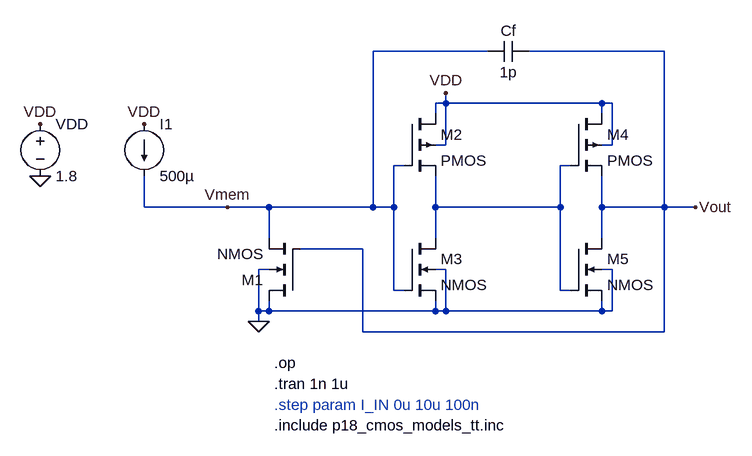
[diagram p0: schematic neuron.asc]
neuron.asc, the LTspice schematic file:
Version 4
SHEET 1 1432 888
WIRE 976 256 800 256
WIRE 1248 256 1040 256
WIRE 912 336 912 320
WIRE 912 336 896 336
WIRE 1152 336 912 336
WIRE 1168 336 1152 336
WIRE 896 352 896 336
WIRE 1152 352 1152 336
WIRE 912 400 912 336
WIRE 912 400 896 400
WIRE 1168 400 1168 336
WIRE 1168 400 1152 400
WIRE 848 432 832 432
WIRE 1104 432 1088 432
WIRE 448 496 448 448
WIRE 576 496 448 496
WIRE 640 496 576 496
WIRE 800 496 800 256
WIRE 800 496 640 496
WIRE 832 496 832 432
WIRE 832 496 800 496
WIRE 896 496 896 448
WIRE 1088 496 1088 432
WIRE 1088 496 896 496
WIRE 1152 496 1152 448
WIRE 1248 496 1248 256
WIRE 1248 496 1152 496
WIRE 1296 496 1248 496
WIRE 640 544 640 496
WIRE 896 544 896 496
WIRE 1152 544 1152 496
WIRE 784 560 688 560
WIRE 640 592 624 592
WIRE 912 592 896 592
WIRE 1168 592 1152 592
WIRE 832 624 832 496
WIRE 848 624 832 624
WIRE 1088 624 1088 496
WIRE 1104 624 1088 624
WIRE 624 656 624 592
WIRE 640 656 640 640
WIRE 640 656 624 656
WIRE 896 656 896 640
WIRE 896 656 640 656
WIRE 912 656 912 592
WIRE 912 656 896 656
WIRE 1152 656 1152 640
WIRE 1152 656 912 656
WIRE 1168 656 1168 592
WIRE 1168 656 1152 656
WIRE 624 672 624 656
WIRE 784 688 784 560
WIRE 1248 688 1248 496
WIRE 1248 688 784 688
FLAG 288 448 0
FLAG 288 368 VDD
FLAG 448 368 VDD
FLAG 624 672 0
FLAG 1296 496 Vout
FLAG 576 496 Vmem
FLAG 912 320 VDD
SYMBOL Voltage 288 352 R0
SYMATTR InstName VDD
SYMATTR Value 1.8
SYMBOL cmosn 688 640 R180
SYMATTR InstName M1
SYMATTR Value NMOS
SYMATTR Value2 l=180n w=2.3u
SYMBOL cmosp 848 352 R0
SYMATTR InstName M2
SYMATTR Value PMOS
SYMATTR Value2 l=180n w=2.3u
SYMBOL cmosp 1104 352 R0
SYMATTR InstName M4
SYMATTR Value PMOS
SYMATTR Value2 l=180n w=2.3u
SYMBOL cmosn 848 544 R0
SYMATTR InstName M3
SYMATTR Value NMOS
SYMATTR Value2 l=180n w=2.3u
SYMBOL cmosn 1104 544 R0
SYMATTR InstName M5
SYMATTR Value NMOS
SYMATTR Value2 l=180n w=2.3u
SYMBOL Cap 1040 240 R90
WINDOW 0 0 32 VBottom 2
WINDOW 3 32 32 VTop 2
SYMATTR InstName Cf
SYMATTR Value 1p
SYMBOL current 448 368 R0
SYMATTR InstName I1
SYMATTR Value 500µ
TEXT 648 736 Left 2 !.op
TEXT 648 768 Left 2 !.tran 1n 1u
TEXT 648 832 Left 2 !.include p18_cmos_models_tt.inc
TEXT 648 800 Left 2 ;.step param I_IN 0u 10u 100n

The netlist it stands for:
* neuron.asc
VDD VDD 0 1.8
M1 0 Vout Vmem 0 NMOS l=180n w=2.3u
M2 VDD Vmem N001 VDD PMOS l=180n w=2.3u
M4 VDD N001 Vout VDD PMOS l=180n w=2.3u
M3 N001 Vmem 0 0 NMOS l=180n w=2.3u
M5 Vout N001 0 0 NMOS l=180n w=2.3u
Cf Vout Vmem 1p
I1 VDD Vmem 500µ
.model NMOS NMOS
.model PMOS PMOS
.lib standard.mos
.op
.tran 1n 1u
.include p18_cmos_models_tt.inc
* .step param I_IN 0u 10u 100n
.backanno
.end